# EAGLE design NonConformingThumbs (EAGLE 9.1.1)
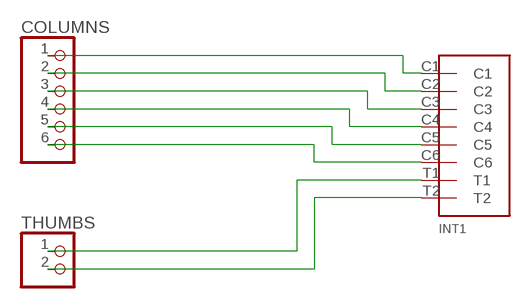
[diagram p0: schematic, sheet 1]

## Parts
COLUMNS  PINHD-1X6  [1X06]
INT1  INTRCNNT4X2  [INTRRIBBON]
THUMBS  PINHD-1X2  [1X02]

## Nets
N$1: COLUMNS.1 INT1.C1
N$2: COLUMNS.2 INT1.C2
N$3: COLUMNS.3 INT1.C3
N$4: COLUMNS.4 INT1.C4
N$5: COLUMNS.5 INT1.C5
N$6: COLUMNS.6 INT1.C6
N$7: INT1.T1 THUMBS.1
N$8: INT1.T2 THUMBS.2

## Library data of the parts
COLUMNS = pinhead:PINHD-1X6: PIN HEADER
INT1 = Keys:INTRCNNT
THUMBS = pinhead:PINHD-1X2: PIN HEADER

## Board
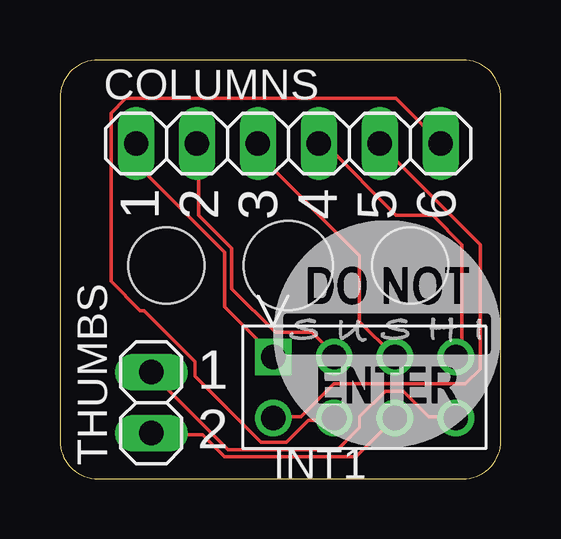
[diagram p1: board, top side]
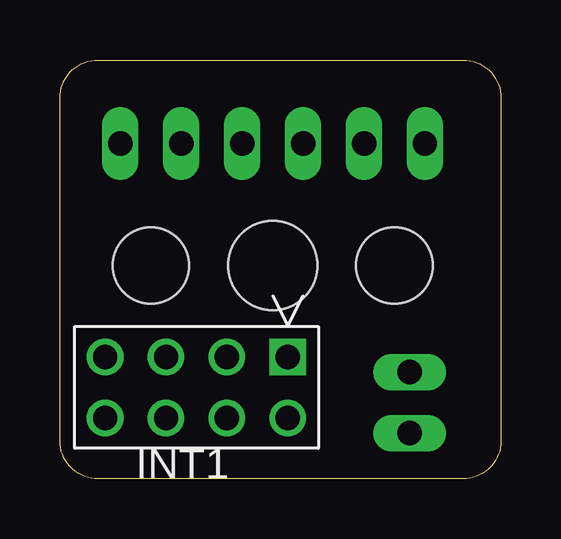
[diagram p2: board, bottom side, seen from below]

Size 18.39 x 17.45 mm. Coordinates in mm from the lower left corner, seen from the top.
Outline: 16.81,17.45 1.59,17.45 arc90 0,15.86 0,1.59 arc90 1.59,0 16.81,0 arc90 18.39,1.59 18.39,15.86 arc90 16.81,17.45
Copper layers (1*16): Top 0.035mm / dielectric 1.5mm / Bottom 0.035mm
Design rules "Sierra": minimum track width 6mil, minimum drill 0.45mm, track to track 6mil, track to pad 6mil, pad to pad 6mil, via to via 6mil, smd to smd 6mil, copper to edge 0.4mm, drill to drill 10mil, minimum pad ring 10mil, minimum via ring 8mil, stop-mask expansion 4mil, vias tented up to drill 0mil, thermal gap 10mil
Holes 3.17 mm at 4.45,8.89 14.61,8.89
Holes 3.71 mm at 9.53,8.89

### Footprints (pad centres in the part's own frame; a part is rotated, then mirrored left to right if it is on the bottom)
1X06 = drill 1.016 long: 1 -6.35,0; 2 -3.81,0; 3 -1.27,0; 4 1.27,0; 5 3.81,0; 6 6.35,0
INTRRIBBON = drill 1.016 square: C1 0,0 | drill 1.016: C2 2.54,0; C3 5.08,0; C4 7.62,0; C5 0,-2.54; C6 2.54,-2.54; T1 5.08,-2.54; T2 7.62,-2.54
1X02 = drill 1.016 long: 1 -1.27,0; 2 1.27,0

### Placement (x,y rotation side)
COLUMNS  9.53,13.97 0 top
INT1  8.89,5.08 0 top
THUMBS  3.81,3.17 90 top
U$1  [3_8INCH_TOP]  8.89,1.27 0 top

### Tracks (layer width: path | path; a pad name or v marks a point on that pad's centre or on a via)
N$1
  Top 0.152: COLUMNS.1 3.2,13.87 3.2,13.11 6.86,9.45 6.86,7.16 8.84,5.18 INT1.C1
N$2
  Top 0.152: COLUMNS.2 5.79,13.87 5.79,10.97 7.16,9.6 7.16,7.92 8.99,6.1 10.52,6.1 11.43,5.18 INT1.C2
N$3
  Top 0.152: COLUMNS.3 8.38,13.87 8.38,13.41 12.5,9.3 12.5,6.55 13.87,5.18 INT1.C3
N$4
  Top 0.152: COLUMNS.4 10.82,13.87 11.12,13.87 14.02,10.97 15.54,10.97 16.76,9.75 16.76,5.33 16.61,5.18 INT1.C4
N$5
  Top 0.152: INT1.C5 8.99,2.59 10.06,2.59 11.43,3.96 16.92,3.96 17.53,4.57 17.53,9.75 13.41,13.87 COLUMNS.5
N$6
  Top 0.152: INT1.C6 11.43,2.44 10.36,2.44 9.45,1.52 8.38,1.52 5.64,4.27 5.64,4.88 3.5,7.01 3.35,7.01 2.13,8.23 2.13,15.24 2.74,15.85 14.02,15.85 15.85,14.02 COLUMNS.6
N$7
  Top 0.152: THUMBS.1 3.81,1.83 5.94,1.83 6.86,0.91 12.34,0.91 13.87,2.44 INT1.T1
N$8
  Top 0.152: INT1.T2 16.46,2.59 15.39,2.59 14.33,3.66 13.56,3.66 12.5,2.59 12.5,2.13 11.58,1.22 7.01,1.22 3.81,4.42 THUMBS.2

### Text on the board
tPlace: 1 / 2 / 3 / 4 / 5 / 6 | 1 / 2